# Altium schematic sheet MikroBus-Connecteur.SchDoc: Mikro Bus - Connecteur
size Letter; ApprovedBy: APPROUVÉ PAR; Organization: Cegep Limoilou; Address1: 1300, 8e Avenue; Address2: Québec, QC; Address3: Canada; Address4: G1J 5L5; SheetNumber: 3; SheetTotal: 7
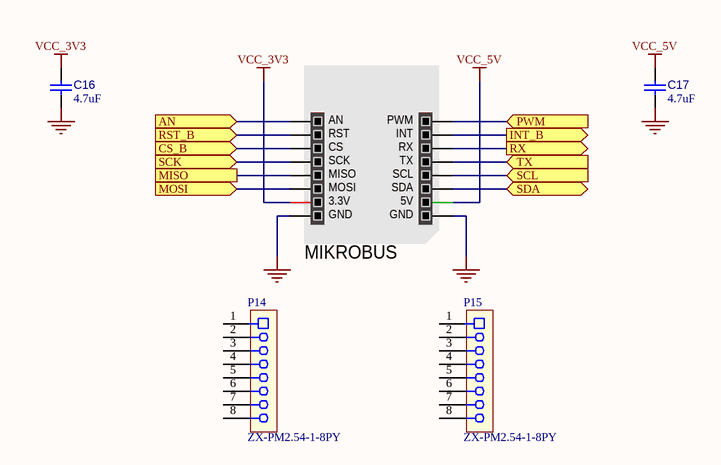
[diagram p0: MikroBus-Connecteur.SchDoc]

## Parts
C16  value 4.7uF  [C_2012[0805]]  (hidden comment: Cap 4.7uF 0805)
C17  value 4.7uF  [C_2012[0805]]  (hidden comment: Cap 4.7uF 0805)
MIKROBUS  MIKROBUS HOST CONN.  [MIKROBUS HOST CONN. TH]  (value not drawn)  (no BOM)
P14  ZX-PM2.54-1-8PY  [CONN_SKT_01X08_100MIL]  (graphical)
P15  ZX-PM2.54-1-8PY  [CONN_SKT_01X08_100MIL]  (graphical)

## Ports
AN (in, see PCB-Support-STM32F407[3B]), CS_B (in, see PCB-Support-STM32F407[3B]), INT_B (out, see PCB-Support-STM32F407[3B]), MISO (see PCB-Support-STM32F407[3B]), MOSI (in, see PCB-Support-STM32F407[3B]), PWM (in, see PCB-Support-STM32F407[3B]), RST_B (in, see PCB-Support-STM32F407[3B]), RX (out, see PCB-Support-STM32F407[3B]), SCK (in, see PCB-Support-STM32F407[3B]), SCL (in, see PCB-Support-STM32F407[3B], PMOD-Connecteur[3C]), SDA (bidir, see PCB-Support-STM32F407[3B], PMOD-Connecteur[3B]), TX (in, see PCB-Support-STM32F407[3B])

## Nets
GND: C16.1 C17.1 MIKROBUS.8(GND) MIKROBUS.9(GND)
VCC_3V3: C16.2 MIKROBUS.7(3.3V)
VCC_5V: C17.2 MIKROBUS.10(5V)
AN: MIKROBUS.1(AN) ; port AN
CS_B: MIKROBUS.3(CS) ; port CS_B
INT_B: MIKROBUS.15(INT) ; port INT_B
MISO: MIKROBUS.5(MISO) ; port MISO
MOSI: MIKROBUS.6(MOSI) ; port MOSI
PWM: MIKROBUS.16(PWM) ; port PWM
RST_B: MIKROBUS.2(RST) ; port RST_B
RX: MIKROBUS.14(RX) ; port RX
SCK: MIKROBUS.4(SCK) ; port SCK
SCL: MIKROBUS.12(SCL) ; port SCL
SDA: MIKROBUS.11(SDA) ; port SDA
TX: MIKROBUS.13(TX) ; port TX

Not connected (* = marked no-connect by the designer): P14 1 2 3 4 5 6 7 8; P15 1 2 3 4 5 6 7 8

## Notes on the sheet
- Titre :
- Conception :
- Date :
- Approbation :
- Heure :
- Révision :
- Feuille
- de
- Fichier :

## Library data of the parts
C16 C17 = CAP003: Capacitor type 1; Manufacturer 1: Taiyo Yuden; Manufacturer Part Number 1: TMK212AB7475KG-T; LibRef: CAP003; CEGEP: KCOND02SM; Tolerance: 10%; Rated Voltage: 25V; Dielectric: X7R; Supplier 1: LCSC; Supplier Part Number 1: C163186; Mounting Technology: SMT
MIKROBUS = MIKROBUS-HOST-CONN: mikroBUS Host Socket
P14 P15 = CONN-100MIL-SKT-01X08: CONN SOCKET 8pos 100mils; Manufacturer 1: Megastar; Mounting Technology: TH; Manufacturer Part Number 1: ZX-PM2.54-1-8PY; Supplier 1: LCSC; Supplier Part Number 1: C7499328